# EAGLE design 2in-2out_1.0f (EAGLE 5.04)
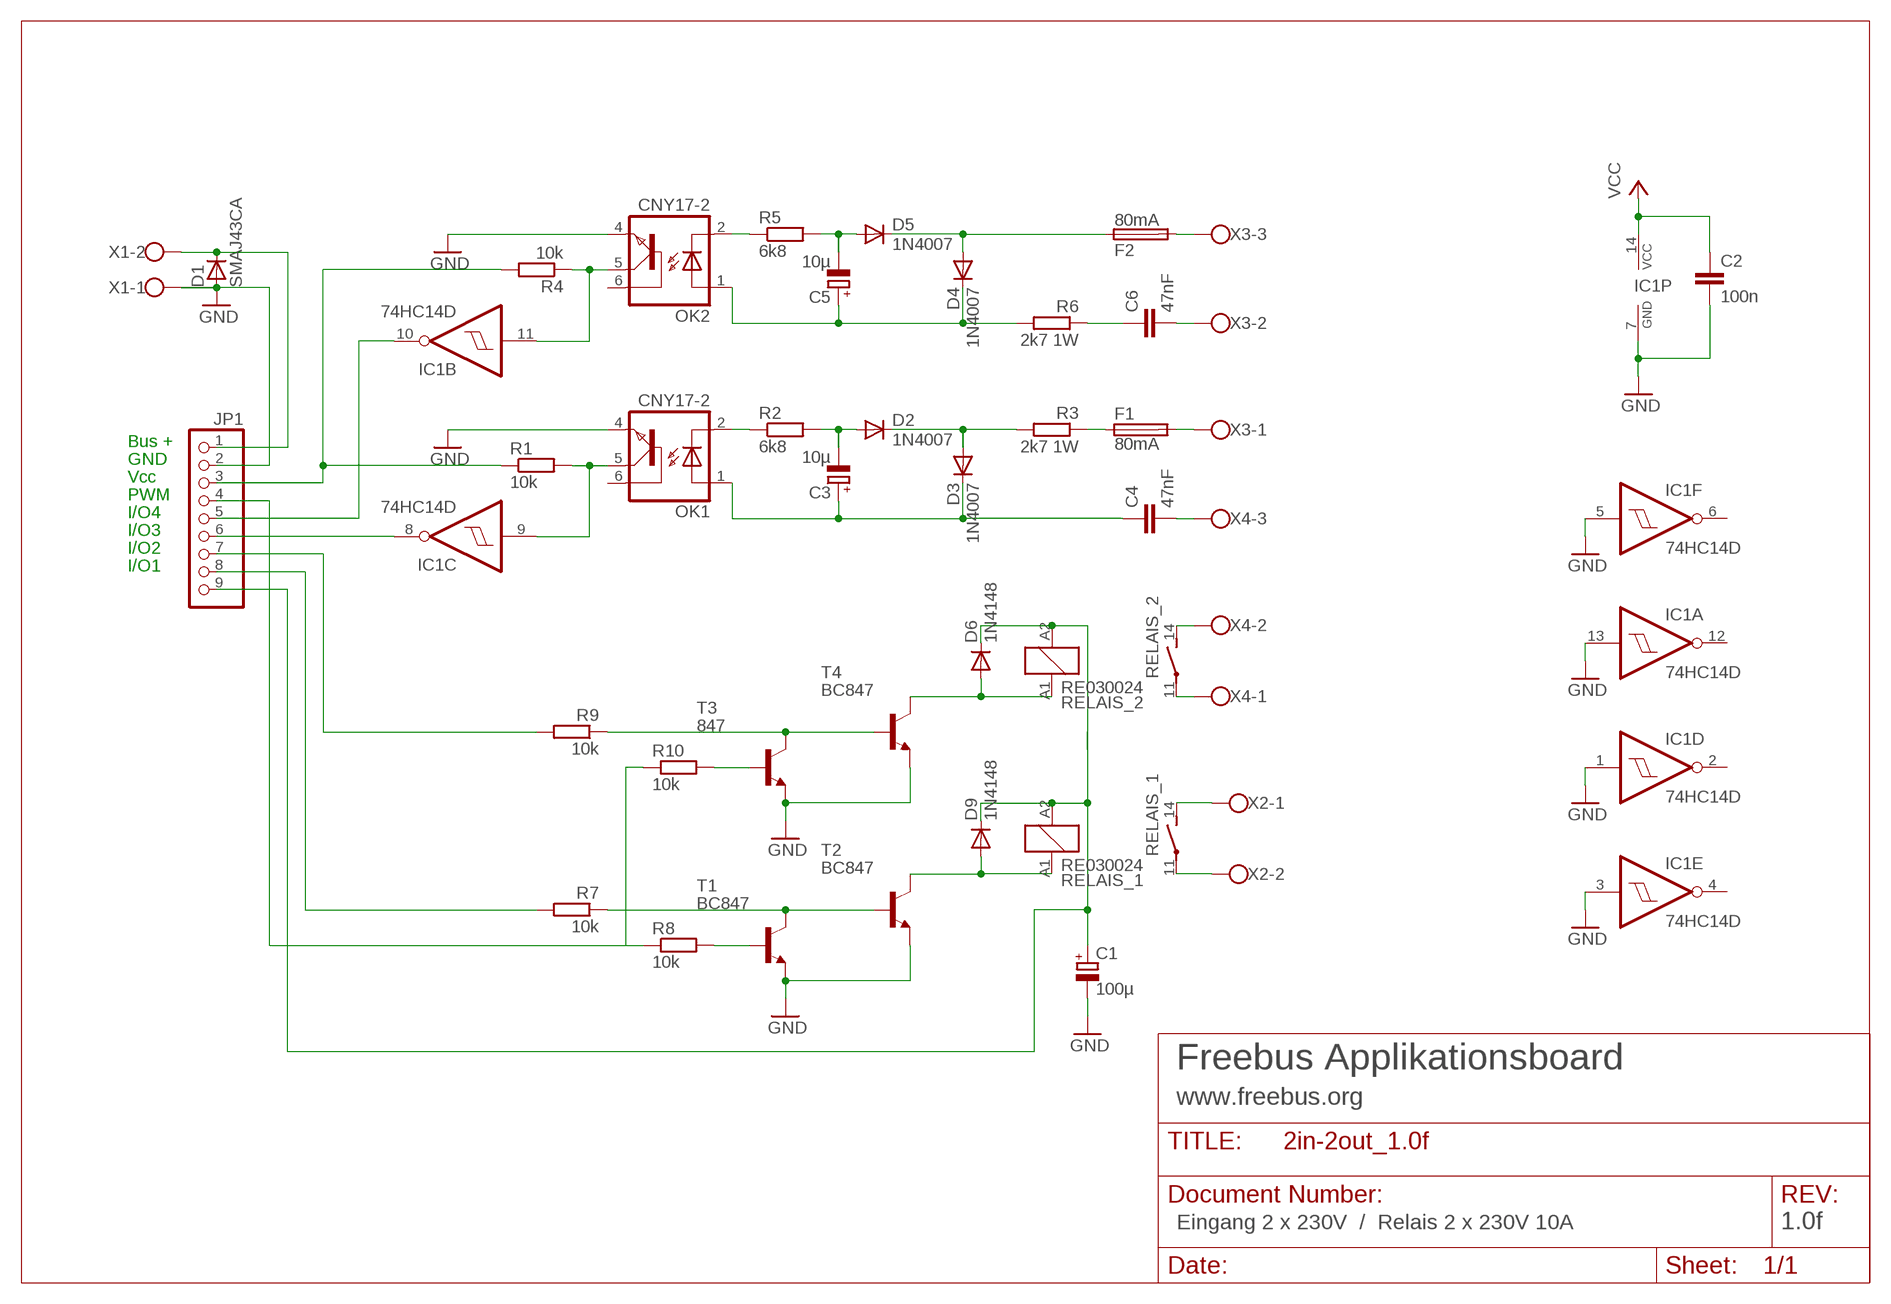
[diagram p0: schematic, sheet 1]

## Parts
C1  100µ  CPOL-EUE3.5-8  [E3,5-8]
C2  100n  C-EUC1206  [C1206]
C3  10µ  CPOL-EUE2-4  [E2-4]
C4  47nF  C-EU075-063X106  [C075-063X106]
C5  10µ  CPOL-EUE2-4  [E2-4]
C6  47nF  C-EU075-063X106  [C075-063X106]
D1  SMAJ43CA  D-SMB  [SMB]
D2  1N4007  DIODE-D-2.5  [D-2.5]
D3  1N4007  DIODE-D-2.5  [D-2.5]
D4  1N4007  DIODE-D-2.5  [D-2.5]
D5  1N4007  DIODE-D-2.5  [D-2.5]
D6  1N4148  DIODE-MINIMELF  [MINIMELF]
D9  1N4148  DIODE-MINIMELF  [MINIMELF]
F1  80mA  FUSE  [0617V]
F2  80mA  FUSE  [0617V]
IC1  74HC14D  [SO14]
JP1  PINHD-1X9  [1X09]
OK1  CNY17-2  CNY17  [DIL06]
OK2  CNY17-2  CNY17  [DIL06]
R1  10k  R-EU_M1206  [M1206]
R2  6k8  R-EU_0207/2V  [0207/2V]
R3  2k7 1W  R-EU_0207/2V  [0207/2V]
R4  10k  R-EU_M1206  [M1206]
R5  6k8  R-EU_0207/2V  [0207/2V]
R6  2k7 1W  R-EU_0207/2V  [0207/2V]
R7  10k  R-EU_M1206  [M1206]
R8  10k  R-EU_M1206  [M1206]
R9  10k  R-EU_M1206  [M1206]
R10  10k  R-EU_M1206  [M1206]
RELAIS_1  RE030024  [RE-SCHRACK]
RELAIS_2  RE030024  [RE-SCHRACK]
T1  BC847  [SOT23]
T2  BC847  [SOT23]
T3  847  BC847  [SOT23]
T4  BC847  [SOT23]
X1  W237-02P  [W237-132]
X2  W237-02P  [W237-132]
X3  W237-3E  [W237-3E]
X4  W237-3E  [W237-3E]

## Nets
EIB+: D1.1(C) JP1.1 X1.2
GND: C1.- C2.2 D1.2(A) IC1.1(D:I) IC1.3(E:I) IC1.5(F:I) IC1.7(P:GND) IC1.13(A:I) JP1.2 OK1.4(EMI) OK2.4(EMI) T1.2(E) T2.2(E) T3.2(E) T4.2(E) X1.1
IO1: JP1.7 R9.2
IO2: JP1.8 R7.2
IO3: IC1.8(C:O) JP1.6
IO4: IC1.10(B:O) JP1.5
N$1: OK1.2(C) R2.1
N$2: RELAIS_1.11(2:P) X2.2
N$3: C3.- D2.A R2.2
N$5: D2.C D3.A R3.2
N$6: RELAIS_1.14(2:S) X2.1
N$7: F1.1 R3.1
N$8: RELAIS_2.14(2:S) X4.2
N$9: RELAIS_2.11(2:P) X4.1
N$10: OK2.2(C) R5.1
N$11: C6.1 R6.1
N$12: F2.2 X3.3
N$13: C5.- D5.A R5.2
N$14: R7.1 T1.3(C) T2.1(B)
N$15: C4.2 X4.3
N$17: R9.1 T3.3(C) T4.1(B)
N$18: D4.A D5.C F2.1
N$19: D6.A RELAIS_2.A1 T4.3(C)
N$20: C5.+ D4.C OK2.1(A) R6.2
N$21: R8.2 T1.1(B)
N$22: R10.2 T3.1(B)
N$24: C3.+ C4.1 D3.C OK1.1(A)
N$25: C6.2 X3.2
N$26: F1.2 X3.1
N$28: IC1.11(B:I) OK2.5(COL) R4.1
N$29: IC1.9(C:I) OK1.5(COL) R1.2
PWM: JP1.4 R8.1 R10.1
R3: D9.A RELAIS_1.A1 T2.3(C)
VCC: C2.1 IC1.14(P:VCC) JP1.3 R1.1 R4.2
VDD_IN: C1.+ D6.C D9.C JP1.9 RELAIS_1.A2 RELAIS_2.A2
Unconnected: IC1.2(D:O) IC1.4(E:O) IC1.6(F:O) IC1.12(A:O) OK1.6(BAS) OK2.6(BAS)

## Notes on the sheet
- Bus +
- GND
- Vcc
- PWM
- I/O4
- I/O3
- I/O2
- I/O1
- Freebus Applikationsboard
- www.freebus.org
- Eingang 2 x 230V  /  Relais 2 x 230V 10A | 1.0f

## Library data of the parts
C1 C3 C5 = rcl:CPOL-EU: POLARIZED CAPACITOR, European symbol
C2 C4 C6 = rcl:C-EU: CAPACITOR, European symbol
D1 = semicon-smd-ipc:D-: DIODE unfilled
D2-D6 D9 = diode:DIODE-: DIODE
F1 F2 = fuse:FUSE: Fuse
IC1 = 74xx-eu:74*14: Hex schmitt trigger INVERTER
JP1 = pinhead:PINHD-1X9: PIN HEADER
OK1 OK2 = optocoupler:CNY17: SIEMENS OPTO COUPLER
R1-R10 = rcl:R-EU_: RESISTOR, European symbol
RELAIS_1 RELAIS_2 = relay:RE03*: Miniature PCB Relay 1 pole 6 A SCHRACK Source: http://www.schrack.com/.. 5812.pdf
T1-T4 = transistor:BC847: NPN TRANSISTOR
X1 X2 = con-wago-508:W237-02P: WAGO SREW CLAMP
X3 X4 = con-wago-508:W237-3E: WAGO SREW CLAMP

## Board
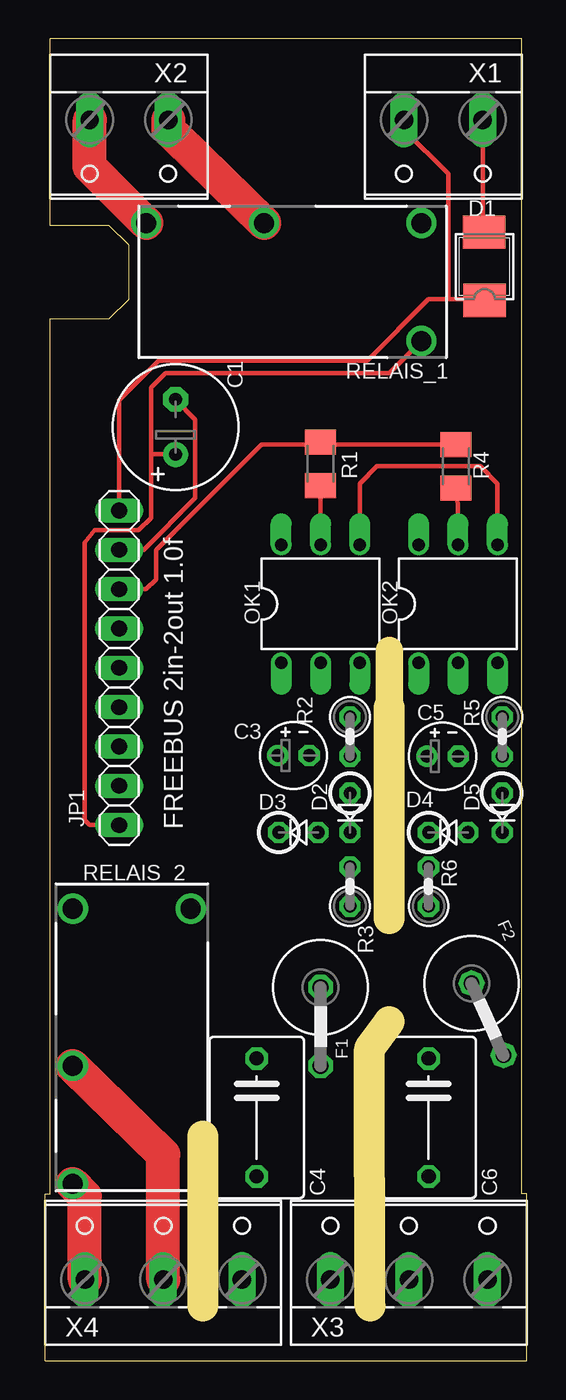
[diagram p1: board, top side]
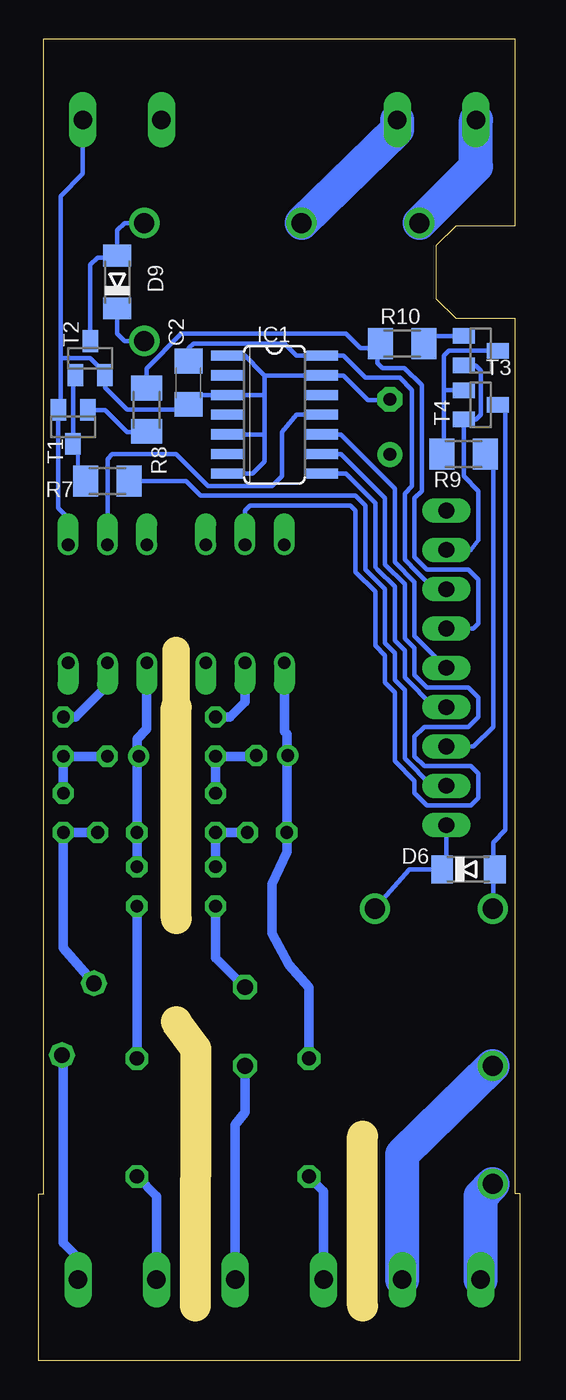
[diagram p2: board, bottom side, seen from below]

Size 31.11 x 85.41 mm. Coordinates in mm from the lower left corner, seen from the top.
Outline: 10.19,3.54 10.19,14.53
Outline: 22.23,21.91 20.95,20.16 20.98,3.54
Outline: 22.23,28.57 22.23,42.23
Outline: 22.23,42.39 22.23,45.88
Outline: 0,0 0,10.79 0.32,10.79 0.32,67.31 4.13,67.31 5.4,68.58 5.4,72.07 4.13,73.34 0.32,73.34 0.32,85.41 30.8,85.41 30.8,10.79 31.11,10.79 31.11,0 0,0
Copper layers (1*16): Top 0.035mm / dielectric 1.5mm / Bottom 0.035mm
Design rules "default_freebus": minimum track width 10mil, minimum drill 24mil, track to track 8mil, track to pad 8mil, pad to pad 8mil, via to via 8mil, smd to smd 8mil, copper to edge 12mil, drill to drill 8mil, minimum pad ring 11mil, minimum via ring 8mil, stop-mask expansion 4mil, vias tented up to drill 0mil, thermal gap 10mil
Milling: 5 lines

### Footprints (pad centres in the part's own frame; a part is rotated, then mirrored left to right if it is on the bottom)
E3,5-8 = drill 0.813 pad 1.6 round: + -1.778,0 | drill 0.813 pad 1.6 octagon: - 1.778,0
C1206 = smd 1.6 x 1.8: 1 -1.4,0; 2 1.4,0
E2-4 = drill 0.813 pad 1.27 round: + -1.016,0 | drill 0.813 pad 1.27 octagon: - 1.016,0
C075-063X106 = drill 0.914 octagon: 1 -3.81,0; 2 3.81,0
SMB = smd 2.159 x 2.743: 1 -2.311,-0.127; 2 2.108,-0.102
D-2.5 = drill 0.813 octagon: A 1.27,0; C -1.27,0
MINIMELF = smd 1.4 x 1.8: A 1.7,0; C -1.7,0
0617V = drill 1.016 octagon: 1 -2.54,0; 2 2.54,0
SO14 = smd 0.66 x 2.032: 1 -3.81,-3.073; 2 -2.54,-3.073; 3 -1.27,-3.073; 4 0,-3.073; 5 1.27,-3.073; 6 2.54,-3.073; 7 3.81,-3.073; 8 3.81,3.073; 9 2.54,3.073; 10 1.27,3.073; 11 0,3.073; 12 -1.27,3.073; 13 -2.54,3.073; 14 -3.81,3.073
1X09 = drill 1.016 long: 1 -10.16,0; 2 -7.62,0; 3 -5.08,0; 4 -2.54,0; 5 0,0; 6 2.54,0; 7 5.08,0; 8 7.62,0; 9 10.16,0
DIL06 = drill 0.813 offset: 1 -2.54,-3.81; 2 0,-3.81; 3 2.54,-3.81; 4 2.54,3.81; 5 0,3.81; 6 -2.54,3.81
M1206 = smd 1.6 x 2: 1 -1.4,0; 2 1.4,0
0207/2V = drill 0.813 octagon: 1 -1.27,0; 2 1.27,0
RE-SCHRACK = drill 1.3 round: 11 8.89,-3.81; 14 1.27,-3.81; A1 -8.89,-3.81; A2 -8.89,3.81
SOT23 = smd 1 x 1.4: 1 -0.95,-1.1; 2 0.95,-1.1; 3 0,1.1
W237-132 = drill 1.194 long: 1 -2.54,-0.635; 2 2.54,-0.635
W237-3E = drill 1.194 long: 1 -5.08,-0.635; 2 0,-0.635; 3 5.08,-0.635

### Placement (x,y rotation side)
C1  8.41,60.33 90 top
C2  21.43,63.18 270 bottom
C3  16.03,39.1 0 top
C4  13.65,15.72 270 top
C5  25.67,39.05 0 top
C6  24.77,15.72 270 top
D1  28.26,70.8 90 top
D2  19.68,35.4 90 top
D3  16.35,34.13 0 top
D4  26.04,34.13 0 top
D5  29.53,35.4 90 top
D6  3.33,31.75 0 bottom
D9  26.04,69.69 90 bottom
F1  17.78,21.59 270 top
F2  28.57,22.07 294 top
IC1  15.87,61.12 270 bottom
JP1  4.76,44.77 270 top
OK1  17.78,48.9 0 top
OK2  26.67,48.9 0 top
R1  17.78,57.94 270 top
R2  19.68,40.32 270 top
R3  19.68,30.64 90 top
R4  26.51,57.79 90 top
R5  29.53,40.32 270 top
R6  24.77,30.64 90 top
R7  26.67,56.83 0 bottom
R8  24.13,61.44 270 bottom
R9  3.65,58.58 0 bottom
R10  7.62,65.72 0 bottom
RELAIS_1  15.4,69.69 180 top
RELAIS_2  5.58,20.32 270 top
T1  28.89,60.33 180 bottom
T2  27.78,64.77 0 bottom
T3  2.54,65.25 270 bottom
T4  2.54,61.75 270 bottom
X1  25.72,79.53 180 top
X2  5.4,79.53 180 top
X3  23.5,5.87 0 top
X4  7.62,5.87 0 top

### Tracks (layer width: path | path; a pad name or v marks a point on that pad's centre or on a via)
EIB+
  Top 0.254: 28.42,68.49 28.42,68.42 | 28.42,68.49 D1.1 | 28.42,68.58 28.42,68.49
  Top 0.305: X1.2 23.18,79.53 26.04,76.68 26.04,68.58 | JP1.1 4.76,62.07 7.3,64.61 20.8,64.61 24.77,68.58 26.04,68.58 | 26.04,68.58 28.42,68.58
GND
  Top 0.254: 28.26,72.71 28.26,72.91 D1.2
  Top 0.305: X1.1 28.26,72.91 | JP1.2 6.35,52.39 9.68,55.72 9.68,60.8 C1.- | OK2.4 29.21,56.67 28.1,57.78 21.43,57.78 20.32,56.67 OK1.4
  Bottom 0.254: 29.84,61.11 T1.2 29.69,61.74 | 21.43,62.39 21.43,61.94 | 19.05,62.39 | 19.05,62.39 IC1.3 | 26.83,63.66 T2.2 | C2.2 21.59,61.78 21.59,61.44 | 12.86,63.66 | 13.02,63.66
  Bottom 0.305: IC1.1 17.94,64.93 17.78,64.93 16.67,63.82 16.51,63.66 | 12.86,63.66 16.51,63.66 | 29.84,61.11 29.84,55.09 29.21,54.45 OK2.4 | 29.69,64.77 29.69,61.74 | 26.83,63.82 27.78,64.77 29.69,64.77 | 29.69,64.77 29.69,75.25 28.26,76.68 X1.1 | 21.59,61.44 25.4,61.44 26.83,62.87 26.83,63.82 | JP1.2 3.17,52.39 2.7,53.02 2.7,56.2 3.65,57.15 3.65,61.12 T4.2 2.86,60.8 2.54,61.12 2.54,63.98 2.86,64.29 3.49,64.29 3.49,64.3 T3.2 | 21.43,61.94 C2.2 | IC1.3 21.43,62.39 | 16.51,59.85 IC1.5 | 16.51,62.39 19.05,62.39 | 17.3,57.31 16.51,58.1 16.51,59.85 | 17.3,57.31 | 17.3,57.31 IC1.7 | 16.51,62.39 16.51,59.85 | 12.86,63.66 IC1.13 11.43,63.66 9.84,62.07 8.73,62.07 C1.- | 12.86,63.66 13.02,63.66 | 26.83,63.82 | 26.83,63.82 | 26.83,63.82 T2.2 | 16.51,63.66 16.51,62.39
IO1
  Bottom 0.254: JP1.7 4.76,39.53
  Bottom 0.305: JP1.7 3.02,39.69 1.75,40.96 1.75,59.05 R9.2
IO2
  Bottom 0.305: R7.2 21.59,56.83 20.64,55.88 10.64,55.88 10,55.24 10,51.12 8.73,49.85 8.73,46.35 8.1,45.72 8.1,43.97 7.46,43.34 7.46,38.89 5.71,37.15 JP1.8
IO3
  Bottom 0.254: 12.86,57.31 | 12.86,57.31 IC1.8
  Bottom 0.305: JP1.6 5.56,42.23 7.46,44.13 7.46,45.88 8.1,46.51 8.1,50.01 9.21,51.12 9.37,51.28 9.37,55.4 11.27,57.31 12.86,57.31
IO4
  Bottom 0.254: 12.86,59.85 | 12.86,59.85 IC1.10
  Bottom 0.305: JP1.5 6.83,46.83 6.83,50.32 8.1,51.59 8.1,56.36 11.59,59.85 12.86,59.85
N$1
  Bottom 0.61: R2.1 18.73,41.59 17.78,42.55 OK1.2
N$2
  Top 2.184: X2.2 2.86,77.15 RELAIS_1.11
  Bottom 2.184: RELAIS_1.11 2.86,77.15 X2.2
N$3
  Bottom 0.61: C3.- 16.83,39.1 16.83,39.05 R2.2 D2.A
N$5
  Bottom 0.61: D2.C | R3.2 D2.C | D2.C D3.A | D3.A
N$6
  Top 0.254: 8.33,79.15 7.94,78.74 X2.1
  Top 2.184: X2.1 7.94,79.53 8.33,79.15 RELAIS_1.14 | X2.1
  Bottom 2.184: X2.1 7.94,79.53 RELAIS_1.14
N$7
  Bottom 0.61: F1.1 19.68,26.04 R3.1
N$8
  Top 2.184: 1.75,19.05 7.62,13.34 X4.2 | X4.2
  Bottom 2.184: RELAIS_2.14 7.62,13.34 X4.2
N$9
  Top 0.254: 2.54,6.35 2.86,6.35 X4.1
  Top 2.184: 1.75,11.43 2.54,10.64 2.54,6.35 X4.1 | X4.1
  Bottom 2.184: RELAIS_2.11 2.54,10.64 X4.1
N$10
  Bottom 0.61: R5.1 28.73,41.59 26.67,43.66 OK2.2
N$11
  Bottom 0.61: C6.1 R6.1
N$12
  Bottom 0.61: X3.3 28.57,6.67 29.53,7.62 29.53,19.68 29.44,19.77 F2.2
N$13
  Bottom 0.61: C5.- R5.2 D5.A
N$14
  Bottom 0.254: 28.89,63.67 T2.1 | 28.89,59.7 T1.3 28.57,59.54 28.57,56.99 R7.1
  Bottom 0.305: 28.89,59.7 28.89,63.67
N$15
  Bottom 0.61: X4.3 12.7,10.95 C4.2
N$17
  Bottom 0.305: R9.1 4.92,59.05 4.92,62.71 | T4.1 3.65,62.7 3.65,62.71 4.92,62.71 | T3.3 4.45,65.25 4.6,65.25 4.92,64.93 4.92,62.71
N$18
  Bottom 0.61: D4.A D5.C 29.53,26.68 F2.1
N$19
  Bottom 0.254: 1.75,31.75 | 1.75,31.75 D6.A
  Bottom 0.305: RELAIS_2.A1 1.75,29.21 1.75,31.75 1.75,33.5 0.95,34.29 0.95,62.07 T4.3
N$20
  Bottom 0.61: 24.77,39.05 D4.C R6.2 | 24.77,39.05 C5.+ | 24.77,39.05 24.77,40.16 24.13,40.8 OK2.1
N$21
  Bottom 0.254: 24.77,60.01 24.77,60.04 R8.2
  Bottom 0.305: T1.1 26.83,61.42 25.4,60.01 24.77,60.01
N$22
  Bottom 0.305: R10.2 6.35,65.41 6.35,66.2 T3.1
N$24
  Bottom 0.61: 15.08,39.26 15.08,40.48 15.24,40.64 OK1.1 | 15.08,39.26 C3.+ | 15.08,39.26 D3.C 15.08,32.86 16.03,30.8 16.03,27.62 14.92,25.56 13.65,24.13 C4.1
N$25
  Bottom 0.61: X3.2 23.5,10.64 C6.2
N$26
  Bottom 0.61: X3.1 18.41,15.24 17.78,16.03 F1.2
N$28
  Top 0.254: 26.67,55.27 R4.1
  Top 0.305: 26.67,55.4 26.67,55.27 OK2.5
  Bottom 0.254: 12.86,61.12 13.02,61.12 IC1.11
  Bottom 0.305: OK2.5 26.67,58.26 26.35,58.58 22.23,58.58 20.16,56.52 16.03,56.52 15.4,57.15 15.4,60.01 14.45,61.12 12.86,61.12
N$29
  Top 0.305: OK1.5 R1.2
  Bottom 0.305: IC1.9 11.59,58.58 8.73,55.72 8.73,51.44 7.46,50.16 7.46,46.67 6.83,46.04 6.83,44.29 6.03,43.5 3.33,43.5 2.7,42.86 2.7,42.39 2.7,41.59 3.33,40.96 6.19,40.96 6.83,40.32 6.83,39.05 6.19,38.42 3.17,38.42 2.7,37.94 2.7,36.35 3.17,35.88 6.03,35.88 6.83,36.67 6.83,37.47 8.1,38.73 8.1,43.18 8.73,43.81 8.73,45.56 9.37,46.2 9.37,49.69 10.64,50.96 10.64,54.93 10.95,55.24 17.46,55.24 17.78,54.93 OK1.5
PWM
  Bottom 0.305: JP1.4 3.02,47.31 2.7,47.62 2.7,50.48 3.33,51.12 6.03,51.12 6.83,51.91 6.83,55.72 6.35,56.2 6.35,63.02 7.46,64.14 8.26,64.14 8.89,64.14 9.21,64.45 9.21,65.41 | R8.1 24.13,64.11 21.91,66.36 11.27,66.36 10.32,65.41 9.21,65.41 | 9.21,65.41 R10.1
R3
  Bottom 0.254: 26.04,71.28 25.88,71.23 D9.A
  Bottom 0.305: RELAIS_1.A1 25.56,73.5 26.04,73.03 26.04,71.28 27.3,71.28 27.78,70.8 T2.3
VCC
  Top 0.305: JP1.3 6.51,49.85 7.14,50.48 7.14,52.39 13.97,59.19 17.78,59.19 | 17.78,59.37 R1.1 17.78,59.19 | 17.78,59.19 R4.2
  Bottom 0.305: JP1.3 5.4,49.85 5.56,49.85 6.67,50.96 7.46,51.75 7.46,56.04 6.99,56.52 6.99,62.71 7.78,63.5 10,63.5 11.43,64.93 IC1.14 14.45,64.93 15.24,65.69 21.11,65.69 21.43,65.41 C2.1
VDD_IN
  Top 0.305: RELAIS_1.A2 22.23,63.82 7.78,63.82 6.83,62.87 6.83,58.58 | C1.+ 8.26,58.58 6.83,58.58 | JP1.9 2.86,34.61 2.54,34.92 2.54,52.86 3.17,53.66 6.03,53.66 6.83,54.45 6.83,58.58
  Bottom 0.254: 5.24,31.75 | D6.C 5.24,31.75 | 26.04,67.83 D9.C
  Bottom 0.305: RELAIS_2.A2 7.14,31.75 5.24,31.75 | D6.C 4.76,31.75 JP1.9 | RELAIS_1.A2 25.56,65.88 26.04,66.36 26.04,66.83 26.04,67.83

### Text on the board
tNames: FREEBUS 2in-2out 1.0f